# Altium schematic sheet JacdacMicroBitBackPackHi-Alt0 119.SchDoc: Complete design
size A4; DocumentNumber: 1; SheetNumber: 1; SheetTotal: 1; VersionControl_RevNumber: 1
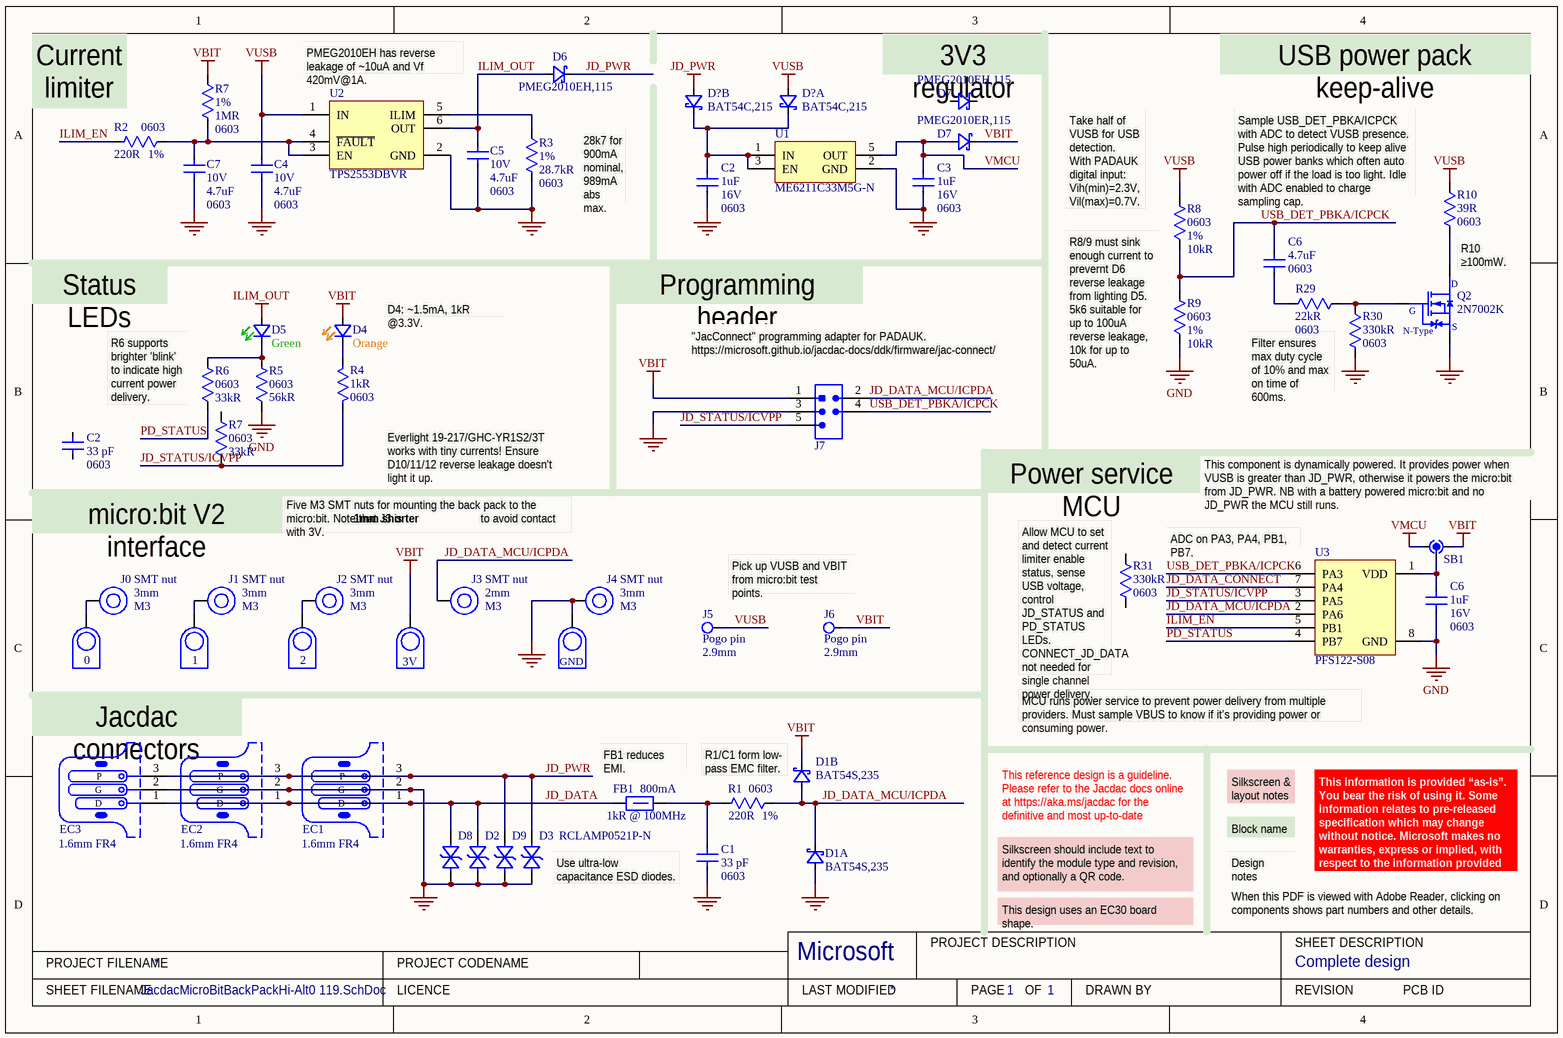
[diagram p0: JacdacMicroBitBackPackHi-Alt0 119.SchDoc]

## Parts
(Parts that share a designator on the sheet are numbered #1, #2 ... from top to bottom, then left to right.)
C1  33 pF  Case/Package: 0603  [CC0603]
C2#1  Voltage: 16V  Case/Package: 0603  Capacitance: 1uF  [C0603 - without outline]  (hidden comment: 1uF 16V)
C2#2  33 pF  Case/Package: 0603  [CC0603]
C3  Voltage: 16V  Case/Package: 0603  Capacitance: 1uF  [C0603 - without outline]  (hidden comment: 1uF 16V)
C4  Voltage Rating: 10V  Capacitance: 4.7uF  Case Code (Imperial): 0603  [C0603 - without outline]  (hidden comment: CL10A475KP8NNNC)
C5  Voltage Rating: 10V  Capacitance: 4.7uF  Case Code (Imperial): 0603  [C0603 - without outline]  (hidden comment: CL10A475KP8NNNC)
C6#1  Capacitance: 4.7uF  Case Code (Imperial): 0603  [C0603 - without outline]  (hidden comment: CL10A475KP8NNNC)
C6#2  Voltage: 16V  Case/Package: 0603  Capacitance: 1uF  [C0603 - without outline]  (hidden comment: 1uF 16V)
C7  Voltage Rating: 10V  Capacitance: 4.7uF  Case Code (Imperial): 0603  [C0603 - without outline]  (hidden comment: CL10A475KP8NNNC)
D1  Manufacturer Part Number: BAT54S,235  [NXP-BAT54S-TO-236AB - without outline]  (hidden comment: BAT54S)  (parts A,B of 2)
D2  RCLAMP0521P-N  [TVS 0402 - XL]  (value not drawn)
D3  RCLAMP0521P-N  [TVS 0402 - XL]
D4  Colour: Orange  [0603 Orange]  (hidden comment: 19-217/S2C-AQ1R1B/3T)
D5  Colour: Green  [0603 Green]
D6  PMEG2010EH,115  [SOD-123W]
D7#1  PMEG2010EH,115  [SOD-123W]
D7#2  PMEG2010ER,115  [SOD-123W]
D8  RCLAMP0521P-N  [TVS 0402 - XL]  (value not drawn)
D9  RCLAMP0521P-N  [TVS 0402 - XL]  (value not drawn)
D?#1  Manufacturer Part Number 1: BAT54C,215  [NXP-BAT54C - without outline]  (hidden comment: BAT54C)  (part B of 2)
D?#2  Manufacturer Part Number 1: BAT54C,215  [NXP-BAT54C - without outline]  (hidden comment: BAT54C)  (part A of 2)
EC1  PCB Type: 1.6mm FR4  [JACDAC_EDGE_CONNECTOR_NO_TRACES]  (hidden comment: 3 pin JACDAC edge connector)  (no BOM)
EC2  PCB Type: 1.6mm FR4  [JACDAC_EDGE_CONNECTOR_NO_TRACES]  (hidden comment: 3 pin JACDAC edge connector)  (no BOM)
EC3  PCB Type: 1.6mm FR4  [JACDAC_EDGE_CONNECTOR_NO_TRACES]  (hidden comment: 3 pin JACDAC edge connector)  (no BOM)
FB1  Current Rating: 800mA  Impedance: 1kR @ 100MHz  [TDK MPZ1608 0.8mm - without outline]  (hidden comment: TDK MPZ1608S102ATA00)
J0  SMT nut  Standoff Height: 3mm  Diameter: M3  [SMTSO-M3-3ET]
J1  SMT nut  Standoff Height: 3mm  Diameter: M3  [SMTSO-M3-3ET]
J2  SMT nut  Standoff Height: 3mm  Diameter: M3  [SMTSO-M3-3ET]
J3  SMT nut  Standoff Height: 2mm  Diameter: M3  [SMTSO-M3-2ET]
J4  SMT nut  Standoff Height: 3mm  Diameter: M3  [SMTSO-M3-3ET]
J5  Pogo pin  Working Height: 2.9mm  [HARWIN-P70-1000045R]
J6  Pogo pin  Working Height: 2.9mm  [HARWIN-P70-1000045R]
J7  Hack Connect Mini 1.27 mm pitch 2-row  [HACK_CONNECT_MINI_5_X_1_27_0.559mm_TH]  (value not drawn)  (no BOM)
J10  micro:bit ring hole  [Microbit_V2_Edge_Connector_Ring_P0]  (value not drawn)  (no BOM)
J11  micro:bit ring hole  [Microbit_V2_Edge_Connector_Ring_P1]  (value not drawn)  (no BOM)
J12  micro:bit ring hole  [Microbit_V2_Edge_Connector_Ring_P2]  (value not drawn)  (no BOM)
J13  micro:bit ring hole  [Microbit_V2_Edge_Connector_Ring_GND]  (value not drawn)  (no BOM)
J14  micro:bit ring hole  [Microbit_V2_Edge_Connector_Ring_3V]  (value not drawn)  (no BOM)
Q2  2N7002K  [SOT23-ONS]
R1  Tolerance: 1%  Case/Package: 0603  [RC0603]  (hidden comment: 220R)
R2  Tolerance: 1%  Case/Package: 0603  [RC0603]  (hidden comment: 220R)
R3  Tolerance: 1%  Resistance: 28.7kR  Case/Package: 0603  [RC0603]  (hidden comment: 28.7k)
R4  Resistance: 1kR  Case/Package: 0603  [RC0603]  (hidden comment: 1k)
R5  value 56kR  Package Size: 0603  [CC0603]  (hidden comment: RES0603_GENERIC)
R6  value 33kR  Package Size: 0603  [CC0603]  (hidden comment: RES0603_GENERIC)
R7#1  Tolerance: 1%  Resistance: 1MR  Case/Package: 0603  [RC0603-M]  (hidden comment: 1M)
R7#2  value 33kR  Package Size: 0603  [CC0603]  (hidden comment: RES0603_GENERIC)
R8  value 10kR  Package Size: 0603  Tolerance: 1%  [CC0603]  (hidden comment: RES0603_GENERIC)
R9  value 10kR  Package Size: 0603  Tolerance: 1%  [CC0603]  (hidden comment: RES0603_GENERIC)
R10  Resistance: 39R  Case Code (Imperial): 0603  [RC0603-M]  (hidden comment: RC0603FR-0739RL)
R29  value 22kR  Package Size: 0603  [CC0603]  (hidden comment: RES0603_GENERIC)
R30  value 330kR  Package Size: 0603  [CC0603]  (hidden comment: RES0603_GENERIC)
R31  value 330kR  Package Size: 0603  [CC0603]  (hidden comment: RES0603_GENERIC)
SB1  Three way open solder blob  [ThreeWaySolderBlob]  (value not drawn)  (no BOM)
U1  ME6211C33M5G-N  [MICRONE-SOT23-5]
U2  TPS2553DBVR  [TI-TPS2553 - without_outline]
U3  PFS122-S08  [SOP-8]

## Nets
GND: C1.1 C2#1.1 C3.1 C4.1 C5.1 C6#2.1 C7.1 D1.1(A) D2.2(A) D3.2(A) D8.2(A) D9.2(A) EC1.2(G) EC2.2(G) EC3.2(G) J4.1 J7.3(GND) J13.1 Q2.2(S) R3.1 R5.1 R9.1 R30.2 U1.2(GND) U2.2(GND) U3.8(GND)
ILIM_OUT: C5.2 D5.2(A) D6.2(A) U2.6(OUT)
JD_PWR: D3.1(K) D6.1(K) D9.1(K) D?#1.2(A) EC1.3(P) EC2.3(P) EC3.3(P)
VBIT: D1.2(K) D4.2(A) D7#2.1(K) J6.1 J7.1(VCC) J14.1 R7#1.2 SB1.1
VMCU: C3.2 D7#2.2(A) SB1.3 U1.5(OUT)
VUSB: C4.2 D?#2.1(A) J5.1 R8.2 R10.2 U2.1(IN)
ILIM_EN: R2.1 U3.5(PB1)
JD_DATA: D2.1(K) D8.1(K) EC1.1(D) EC2.1(D) EC3.1(D) FB1.1
JD_DATA_CONNECT: U3.7(PA4)
JD_DATA_MCU/ICPDA: D1.3(K) J3.1 J7.2(SWDIO) R1.2 U3.2(PA6)
JD_STATUS/ICVPP: J7.5(RESET) R4.2 R7#2.1 U3.3(PA5)
PD_STATUS: R6.1 U3.4(PB7)
USB_DET_PBKA/ICPCK: C6#1.1 J7.4(SWCLK) R8.1 R9.2 U3.6(PA3)
NetC1_2: C1.2 FB1.2 R1.1
NetC2#1_2: C2#1.2 D?#1.3(K) D?#2.3(K) U1.1(IN) U1.3(EN)
NetC6#1_2: C6#1.2 R29.2
NetC6#2_2: C6#2.2 SB1.2 U3.1(VDD)
NetC7_2: C7.2 R2.2 R7#1.1 U2.3(EN) U2.4(~{FAULT})
NetD4_1: D4.1(K) R4.1
NetD5_1: D5.1(K) R5.2 R6.2
NetJ0_1: J0.1 J10.1
NetJ1_1: J1.1 J11.1
NetJ2_1: J2.1 J12.1
NetQ2_1: Q2.1(G) R29.1 R30.1
NetQ2_3: Q2.3(D) R10.1
NetR3_2: R3.2 U2.5(ILIM)

Not connected (* = marked no-connect by the designer): C2#2 1 2; D7#1 1(K) 2(A); R7#2 2; R31 1 2

## Notes on the sheet
- (near R2) Current limiter
- (near U2) PMEG2010EH has reverse leakage of ~10uA and Vf 420mV@1A.
- (near D7#1) 3V3 regulator
- USB power pack keep-alive
- 28k7 for 900mA nominal,
  989mA abs max.
- (near R8) Take half of VUSB for USB detection.
  With PADAUK digital input: Vih(min)=2.3V, Vil(max)=0.7V.
- (near R10) Sample USB_DET_PBKA/ICPCK with ADC to detect VUSB presence. Pulse high periodically to keep alive USB power banks which often auto power off if the load is too light. Idle with ADC enabled to charge sampling cap.
- Status LEDs
- D4: ~1.5mA, 1kR @3.3V.
- Programming header
- R10 ≥100mW.
- (near J7) "JacConnect" programming adapter for PADAUK.
  https://microsoft.github.io/jacdac-docs/ddk/firmware/jac-connect/
- R8/9 must sink enough current to prevernt D6 reverse leakage from lighting D5. 5k6 suitable for up to 100uA reverse leakage, 10k for up to 50uA.
- Filter ensures max duty cycle of 10% and max on time of 600ms.
- (near R6) R6 supports brighter 'blink' to indicate high current power delivery.
- 1mm shorter
- (near R4) Everlight 19-217/GHC-YR1S2/3T works with tiny currents! Ensure D10/11/12 reverse leakage doesn't light it up.
- Power service MCU
- This component is dynamically powered. It provides power when VUSB is greater than JD_PWR, otherwise it powers the micro:bit from JD_PWR. NB with a battery powered micro:bit and no JD_PWR the MCU still runs.
- micro:bit V2 interface
- Five M3 SMT nuts for mounting the back pack to the micro:bit. Note that J3 is                         to avoid contact with 3V.
- ADC on PA3, PA4, PB1, PB7.
- Pick up VUSB and VBIT from micro:bit test points.
- (near U3) MCU runs power service to prevent power delivery from multiple providers. Must sample VBUS to know if it's providing power or consuming power.
- (near R31) Allow MCU to set and detect current limiter enable status, sense USB voltage, control JD_STATUS and PD_STATUS LEDs. CONNECT_JD_DATA not needed for single channel power delivery.
- Jacdac connectors
- (near FB1) FB1 reduces EMI.
- (near D1) R1/C1 form low- pass EMC filter.
- This reference design is a guideline. Please refer to the Jacdac docs online at https://aka.ms/jacdac for the definitive and most up-to-date information.
- Block name
- Silkscreen & layout notes
- Use ultra-low capacitance ESD diodes.
- This design uses an EC30 board shape.
- Silkscreen should include text to identify the module type and revision, and optionally a QR code.
- D1 clamps JD_DATA to protect MCU.
- Design notes
- When this PDF is viewed with Adobe Reader, clicking on components shows part numbers and other details.
- This information is provided “as-is”. You bear the risk of using it. Some information relates to pre-released specification which may change without notice. Microsoft makes no warranties, express or implied, with respect to the information provided here.
- PROJECT FILENAME
- PROJECT CODENAME
- Microsoft
- PROJECT DESCRIPTION
- SHEET DESCRIPTION
- SHEET FILENAME
- LICENCE
- LAST MODIFIED
- PAGE
- OF
- DRAWN BY
- REVISION
- PCB ID
- (in symbol 2N7002K) N-Type
- (in symbol micro:bit edge connector ring 3V) 3V
- (in symbol micro:bit edge connector ring GND) GND
- (in symbol micro:bit edge connector ring P0) 0
- (in symbol micro:bit edge connector ring P2) 2

## Library data of the parts
C1 C2#2 = CC0603JRNPO9BN330: 33pF 0603 100V C0G/NPO; Manufacturer: Yageo; Dielectric: C0G; Tolerance: 5%; Supplier 1: Digi-Key; Manufacturer Part Number: CC0603JRNPO9BN330; RoHS: Yes; Category: Ceramic Capacitors; Mount: Surface Mount; Weight: 7.1E-05oz; Case Code (Imperial): 0603; Case Code (Metric): 1608; Min Operating Temperature: -55°C; Max Operating Temperature: 125°C; Capacitance: 33pF; Termination: SMD/SMT; Composition: Ceramic; Packaging: Tape and Reel; Voltage Rating: 100V; Voltage Rating (DC): 100V; Length: 1.6mm; Height: 0.8mm; Thickness: 0.035inch; Depth: 0.8mm; Width: 0.8mm; Lead Free: Lead Free; ComponentLink1URL: https://datasheet.ciiva.com/13207/upy-gp-np0-16v-to-50v-8-13207786.pdf; ComponentLink1Description: Online datasheet; Manufacturer 1: Yageo; Manufacturer Part Number 1: CC0603JRNPO9BN330
C2#1 C3 C6#2 = CL10A105KO8NNNC: SMD Multilayer Ceramic Capacitor, 1 µF, 16 V, 0603 [1608 Metric], ± 10%, X5R, CL Series; Manufacturer: Samsung; ComponentLink1URL: https://datasheet.lcsc.com/lcsc/1811021622_Samsung-Electro-Mechanics-CL10A105KO8NNNC_C1592.pdfq; ComponentLink1Description: Online datasheet; Supplier 1: Digi-Key; Manufacturer Part Number: CL10A105KO8NNNC; RoHS: Yes; Category: Ceramic Capacitors; Stock 1: 3575337; Pricing 1: 1=0.10000, 10=0.03600, 50=0.01960, 100=0.01600, 500=0.01144, 1000=0.00898 (USD); Mount: Surface Mount; Case Code (Metric): 1608; Case Code (Imperial): 0603; Material: Ceramic; Contact Plating: Tin; Min Operating Temperature: -55°C; Max Operating Temperature: 85°C; Tolerance: 10%; Package Quantity: 1; Packaging: Tape and Reel; Voltage Rating: 16V; Dielectric: X5R; Voltage Rating (DC): 16V; Series: CL; Construction: Flat; Length: 1.6mm; Width: 0.031inch; Height: 0.8mm; Thickness: 0.035inch; Depth: 0.8mm; Radiation Hardening: No; Lead Free: Lead Free; RoHS Compliant: Yes; Supplier 2: Farnell; Supplier 3: RSComponents; Supplier 4: Mouser; Supplier Part Number 1: 1276-1034-1-ND; Supplier Part Number 2: 3013384; Supplier Part Number 3: 7664780; Supplier Part Number 4: 187-CL10A105KO8NNNC; Supplier 5: LCSC; Supplier Part Number 5: C1592; Manufacturer 1: Samsung; Manufacturer Part Number 1: CL10A105KO8NNNC
C4 C5 C6#1 C7 = CL10A475KP8NNNC: CAP CER 4.7UF 10V X5R 0603; Manufacturer: Samsung; Tolerance: 10%; Supplier 1: Farnell; Manufacturer Part Number: CL10A475KP8NNNC; RoHS: Yes; Category: Ceramic Capacitors; Stock 1: 75690; Pricing 1: 10=0.02700, 100=0.02160, 500=0.01580, 1000=0.01310, 2000=0.01130 (GBP); Mount: Surface Mount; Case/Package: 0603; Case Code (Metric): 1608; Contact Plating: Tin; Min Operating Temperature: -55°C; Max Operating Temperature: 85°C; Dielectric: X5R; Package Quantity: 1; Packaging: Tape and Reel; Series: CL; Construction: Flat; Length: 1.6mm; Width: 0.031inch; Height: 0.8mm; Thickness: 0.035inch; Depth: 0.8mm; Radiation Hardening: No; RoHS Compliant: Yes; ComponentLink1URL: https://datasheet.ciiva.com/25797/cl10a475kp8nnnc-25797520.pdf; ComponentLink1Description: Online datasheet; Supplier 2: Digi-Key; Pricing 2: 1=0.10000, 10=0.04900, 50=0.02680, 100=0.02180, 500=0.01558, 1000=0.01224 (USD); Supplier Part Number 2: 1276-1044-1-ND; Supplier Part Number 1: 3013398; Created By: D Gakure; Checked By: ?
  C6#1: Voltage Rating: 10V
D1 = BAT54S: DIODE ARRAY SCHOTTKY 30V SOT23; Manufacturer: Nexperia; Supplier 1: Digi-Key; RoHS: No; Category: Rectifier Diodes; Stock 1: 14011; Pricing 1: 1=0.13000, 10=0.11900, 100=0.05610, 500=0.03326, 1000=0.02185, 5000=0.02138 (USD); ComponentLink1URL: https://assets.nexperia.com/documents/data-sheet/BAT54_SER.pdf; ComponentLink1Description: NXP datasheet online; Supplier 2: Mouser; Supplier 3: RSComponents; Supplier Part Number 2: 771-BAT54S235; Supplier Part Number 3: 1707990; Supplier Part Number 1: 1727-1868-1-ND; Manufacturer 1: Nexperia; Manufacturer Part Number 1: BAT54S,235
D2 D3 D8 D9 = RCLAMP0521P-N: Bidirectional 5V (Max) 6V 16V 3.5A (8/20us) 0402 TVS RoHS; Manufacturer: Born Semiconductor; Package: 0402; Created By: D Gakure; Checked By: ?; Supplier1: LCSC; Supplier1 Part Number: C316043; ComponentLink1Description: Online datasheet; ComponentLink1URL: https://datasheet.lcsc.com/szlcsc/Bourne-Semicon-Shenzhen-RCLAMP0521P-N_C316043.pdf; Manufacturer Part Number: RCLAMP0521P-N; Manufacturer 1: Born Semiconductor; Manufacturer Part Number 1: RCLAMP0521P-N
D4 = 19-217/S2C-AQ1R1B/3T: LED ORANGE DIFFUSED 0603 SMD; Manufacturer: Everlight Elec; Manufacturer Part Number: 19-217/S2C-AQ1R1B/3T; Mount: Surface Mount; Case/Package: 0603; Color: Orange; Case Code (Imperial): 0603; ComponentLink1URL: https://datasheet.lcsc.com/lcsc/1912171731_Everlight-Elec-19-217-S2C-AQ1R1B-3T_C146215.pdf; ComponentLink1Description: Online datasheet; Supplier 1: LCSC; Supplier 1 Part Number: C146215
D5 = 19-217/GHC-YR1S2/3T: LED GREEN DIFFUSED 0603 SMD; Manufacturer 1: Everlight Elec; Manufacturer Part Number 1: 19-217/GHC-YR1S2/3T; Mount: Surface Mount; Case/Package: 0603; Color: Green; Case Code (Imperial): 0603; ComponentLink1URL: https://datasheet.lcsc.com/lcsc/1811101510_Everlight-Elec-19-217-GHC-YR1S2-3T_C72043.pdf; ComponentLink1Description: Online datasheet; Supplier 1: LCSC; Supplier 1 Part Number: C72043
D6 D7#1 = PMEG2010EH,115: NEXPERIA - PMEG2010EH,115 - DIODE, RECT SCH, 20V, 1A, SOD123f; Manufacturer: Nexperia; RoHS: Yes; RoHS Compliant: Yes; ComponentLink1URL: https://datasheet.lcsc.com/lcsc/2006101640_Nexperia-PMEG2010EH-115_C552825.pdf; ComponentLink1Description: Online datasheet; Manufacturer Part Number: PMEG2010EH,115
D7#2 = PMEG2010ER,115: NEXPERIA - PMEG2010ER,115 - DIODE, RECT SCH, 20V, 1A, SOD123W; Supplier 1: Digi-Key; Manufacturer: Nexperia; RoHS: Yes; Stock 1: 722; Pricing 1: 1=0.42000, 10=0.31300, 100=0.19480, 500=0.13328, 1000=0.10252 (USD); RoHS Compliant: Yes; ComponentLink1URL: http://www.farnell.com/datasheets/1383341.pdf; ComponentLink1Description: Online datasheet; Supplier 2: Future Electronics; Stock 2: 144000; Pricing 2: 3000=0.20000, 6000=0.16300, 9000=0.16200, 12000=0.16100, 15000=0.16000 (USD); Supplier 3: RSComponents; Stock 3: 1; Pricing 3: 50=0.32100, 100=0.26700, 250=0.21200, 500=0.11100, 1000=0.08200 (USD); Supplier 4: Mouser; Stock 4: 2146; Pricing 4: 1=0.37000, 10=0.25700, 50=0.25700, 100=0.13400, 1000=0.09400, 10000=0.07200 (USD); Supplier 5: Farnell; Stock 5: 24250; Pricing 5: 5=0.40400, 10=0.27600, 100=0.13400, 500=0.11500, 1000=0.07750 (GBP); Supplier Part Number 5: 1907681; Supplier Part Number 4: 771-PMEG2010ER115; Supplier Part Number 3: 8166824P; Supplier Part Number 2: 4222907; Supplier Part Number 1: 1727-5192-1-ND; Manufacturer Part Number: PMEG2010ER,115
D?#1 D?#2 = BAT54C: BAT54 Series 30V 2 uA Surface Mount Schottky Barrier Diode - SOT-23; Manufacturer 1: Nexperia; Manufacturer: Manufacturer 1; Supplier 1: Digi-Key; RoHS: No; Category: Rectifier Diodes; Stock 1: 155983; Pricing 1: 1=0.13000, 10=0.11900, 100=0.05610, 500=0.03326, 1000=0.02185 (USD); ComponentLink2URL: https://assets.nexperia.com/documents/data-sheet/BAT54C.pdf; ComponentLink2Description: NXP datasheet online; Supplier 2: Farnell; Supplier 3: Mouser; Supplier 4: RSComponents; Supplier Part Number 4: 4367789; Supplier Part Number 3: 771-BAT54C-T/R; Supplier Part Number 2: 1081192; Supplier Part Number 1: 1727-2902-1-ND; Manufacturer Part Number: BAT54C,215
EC1-EC3 = Jacdac edge connector: 3 pin Jacdac edge connector 1.27mm pitch; Manufacturer Part Number: JACDAC_EDGE_CONNECTOR; Checked By: ?; Created By: D. Gakure; ComponentLink1Description: Yuliang JACDAC cable connector drawing online; ComponentLink1URL: https://github.com/microsoft/jacdac-mdk/blob/main/connector/JACDAC-Connector-by-Yuliang-2020-11-28.pdf; ComponentLink2Description: JACDAC PCB edge connector spec onlin; ComponentLink2URL: https://github.com/microsoft/jacdac-mdk/blob/main/connector/JACDAC_PCB_Edge_Connector_Drawing_JD-PEC-01_rev_01.pdf
FB1 = TDK MPZ1608S102ATA00: 0603 1k@100MHz 0.8A chip; Core Material: Ferrite; Tolerance: 25%; DC Resistance (DCR): 300mR; Supplier 1: Digi-Key; Stock 1: 113542; Pricing 1: 1=0.1, 10=0.079, 25=0.0716, 50=0.0644, 100=0.0472, 250=0.03432, 500=0.03146, 1000=0.02717 (USD); Mount: Surface Mount; Case/Package: 0603; Case Code (Metric): 1608; Case Code (Imperial): 0603; Package Quantity: 4000; Packaging: Tape and Reel; Max DC Current: 800mA; Length: 0.063inch; Height: 0.037inch; Width: 0.031inch; ComponentLink2URL: https://www.mouser.co.uk/datasheet/2/400/eads_commercial_power_mpz1608_en-923650.pdf; ComponentLink2Description: datasheet online; Supplier 2: Mouser; ComponentLink3Description: datasheet; ComponentLink3URL: Y:\System\Altium\Libraries 2014\TDK\Datasheets\eads_commercial_power_mpz1608_en-923650.pdf; Supplier Part Number 1: 445-8694-1-ND; Supplier Part Number 2: 810-MPZ1608S102ATA00; Manufacturer: TDK; Manufacturer Part Number: MPZ1608S102ATA00; Manufacturer 1: TDK; Manufacturer Part Number 1: MPZ1608S102ATA00
J0-J2 J4 = SMTSO-M3-3ET: Standoff Round Swage F/F M3 X 0.5-THD Carbon Steel Electro-Tin ASTM B545 Automotive; Manufacturer 1: PennEngineering; Supplier 1: Mouser; Manufacturer Part Number 1: SMTSO-M3-3ET; RoHS: No; Supplier Part Number 1: 153-SMTSO-M3-3ET; Manufacturer: PennEngineering; Manufacturer Part Number: SMTSO-M3-3ET
J3 = SMTSO-M3-2ET: Standoff Round Swage F/F M3 X 0.5-THD Carbon Steel Electro-Tin ASTM B545 Automotive; Manufacturer 1: PennEngineering; Supplier 1: Mouser; Manufacturer Part Number 1: SMTSO-M3-2ET; RoHS: No; Supplier Part Number 1: 153-SMTSO-M3-2ET; Manufacturer: PennEngineering; Manufacturer Part Number: SMTSO-M3-2ET
J5 J6 = HARWIN-P70-1000045R: Spring Loaded Contact, Pin, 2.9mm, SMT; Manufacturer 1: Harwin; Plating: Gold; Current Rating: 2A; Supplier 1: Digi-Key; Manufacturer Part Number 1: P70-1000045R; RoHS: Yes; Category: Connectors; Stock 1: 1152; Pricing 1: 1=1.02000, 10=0.85900, 25=0.82400, 50=0.80660, 100=0.77150, 250=0.70140, 500=0.63126 (USD); Mount: Surface Mount; Material: Brass; REACH SVHC: No SVHC; RoHS Compliant: Yes; ComponentLink1URL: https://cdn.harwin.com/pdfs/P70-10X.pdf; ComponentLink1Description: Harwin drawing online; ComponentLink2URL: http://www.farnell.com/datasheets/2151575.pdf; ComponentLink2Description: Harwin catalogue page online; Manufacturer Part Number: P70-1000045R; Manufacturer: Harwin; Supplier Part Number 1: 952-3127-1-ND; Supplier 2: Farnell; Supplier 3: Mouser; Supplier Part Number 2: 2664910; Supplier Part Number 3: 855-P70-1000045R; Length: 3.5mm
J7 = HACK_CONNECT_MINI
J10 = micro:bit edge connector ring P0: One ring like those on the micro:bit edge connector, designed to take a 4mm banana plug
J11 = micro:bit edge connector ring P1: One ring like those on the micro:bit edge connector, designed to take a 4mm banana plug
J12 = micro:bit edge connector ring P2: One ring like those on the micro:bit edge connector, designed to take a 4mm banana plug
J13 = micro:bit edge connector ring GND: One ring like those on the micro:bit edge connector, designed to take a 4mm banana plug
J14 = micro:bit edge connector ring 3V: One ring like those on the micro:bit edge connector, designed to take a 4mm banana plug
Q2 = 2N7002K: MOSFET Transistor, N Channel, 300 mA, 60 V, 2 ohm, 10 V, 2.5 V; Manufacturer: ON Semiconductor / Fairchild; Max Power Dissipation: 350mW; Continuous Drain Current (ID): 300mA; Input Capacitance: 50pF; Number of Elements: 1; Rds On Max: 2R; Drain to Source Breakdown Voltage: 60V; Threshold Voltage: 2.5V; Element Configuration: Single; Gate to Source Voltage (Vgs): 20V; Turn-Off Delay Time: 30ns; Turn-On Delay Time: 5ns; Polarity: N-CHANNEL; Supplier 1: Digi-Key; Stock 1: 53564; Pricing 1: 1=0.40000, 10=0.32500, 25=0.27240, 100=0.17240, 500=0.11344, 1000=0.07714 (USD); Case/Package: SOT-23; Number of Pins: 3; Contact Plating: Tin,Matte; Min Operating Temperature: -55°C; Max Operating Temperature: 150°C; Packaging: Tape and Reel; Power Dissipation: 350mW; Package Quantity: 1; Drain to Source Resistance: 2R; On-State Resistance: 2R; Length: 2.92mm; Height: 1.2mm; Width: 1.3mm; Radiation Hardening: No; Lead Free: Lead Free; REACH SVHC: No SVHC; Supplier 2: Mouser; ComponentLink1Description: Online datasheet; ComponentLink1URL: https://www.onsemi.com/pdf/datasheet/2n7002k-d.pdf; Supplier Part Number 2: 512-2N7002K; Supplier Part Number 1: 2N7002KCT-ND; Manufacturer Part Number: 2N7002K; Supplier 3: Farnell; Supplier Part Number 3: 2453382; Category: MOSFETs; Checked By: ?; Created By: D. Gakure; Drain-source On Resistance-Max: 2R; Drain to Source Voltage (Vdss): 60V; Mount: Surface Mount; Pricing 2: 1=0.40000, 10=0.27300, 50=0.27300, 100=0.13400, 1000=0.07800, 10000=0.05100 (USD); Pricing 3: 5=0.34800, 10=0.23500, 100=0.09100, 500=0.05850, 3000=0.04630, 9000=0.03860, 24000=0.03750, 45000=0.03530 (GBP); RoHS: Yes; Stock 2: 111825; Stock 3: 101059; Voltage: 60V
R1 R2 = RC0603FR-07220RL: Res Thick Film 0603 220 Ohm 1% 0.1W(1/10W) ±100ppm/°C Pad SMD T/R; Manufacturer 1: Yageo; Voltage Rating (DC): 50V; Power Rating: 100mW; ComponentLink4URL: https://datasheet.ciiva.com/46395/443971-46395002.pdf; ComponentLink4Description: online datasheet; Supplier 1: Digi-Key; Manufacturer Part Number 1: RC0603FR-07220RL; RoHS: Yes; Category: Chip SMD Resistors; Stock 1: 1257522; Pricing 1: 1=0.10000, 10=0.02300, 100=0.00930, 1000=0.00417, 2500=0.00362 (USD); Number of Pins: 2; Case Code (Imperial): 0603; Case Code (Metric): 1608; Size Code: 0603; Min Operating Temperature: -55°C; Max Operating Temperature: 155°C; Resistor Type: Thick Film; Temperature Coefficient: 100ppm/°C; Packaging: Tape and Reel; Voltage Rating: 50V; Package Quantity: 1; Termination: SMD/SMT; Number of Terminations: 2; Max Power Dissipation: 100mW; Features: Moisture Resistant; Series: RC; Resistance Tolerance: 1%; Construction: Rectangular; Length: 1.6mm; Width: 0.031inch; Height: 0.022inch; Depth: 0.8mm; REACH SVHC: No SVHC; Lead Free: Lead Free; RoHS Compliant: Yes; Military Standard: Not; Supplier 2: Farnell; Supplier 3: Mouser; Supplier 4: RSComponents; Supplier Part Number 2: 2421863; Supplier Part Number 3: 603-RC0603FR-07220RL; Supplier Part Number 4: 1995497; Supplier Part Number 1: 311-220HRCT-ND; Manufacturer: Yageo; Manufacturer Part Number: RC0603FR-07220RL; Resistance: 220R
R3 = RC0603FR-0728K7L: Res Thick Film 0603 28.7k Ohm 1% 0.1W(1/10W) ±100ppm/C Pad SMD T/R; Manufacturer 1: Yageo; Voltage Rating: 50V; Power Rating: 100mW; Temperature Coefficient: 100ppm/°C; Supplier 1: Digi-Key; Manufacturer Part Number 1: RC0603FR-0728K7L; RoHS: Yes; Category: Chip SMD Resistors; Stock 1: 276730; Pricing 1: 1=0.10000, 10=0.02300, 100=0.00930, 1000=0.00417, 2500=0.00362 (USD); Mount: Surface Mount; Case Code (Imperial): 0603; Case Code (Metric): 1608; Size Code: 0603; Min Operating Temperature: -55°C; Max Operating Temperature: 155°C; Packaging: Tape and Reel; Package Quantity: 1; Resistor Type: Thick Film; Termination: SMD/SMT; Number of Terminations: 2; Max Power Dissipation: 100mW; Voltage Rating (DC): 50V; Features: Moisture Resistant; Series: RC; Construction: Rectangular; Technology: THICK FILM; Length: 1.6mm; Width: 0.031inch; Height: 0.022inch; Depth: 0.8mm; Military Standard: Not; Lead Free: Lead Free; RoHS Compliant: Yes; ComponentLink5URL: https://datasheet.ciiva.com/2553/pyu-r-int-thick-7-2553533.pdf; ComponentLink5Description: onilne datasheet; Manufacturer: Yageo; Manufacturer Part Number: RC0603FR-0728K7L; Supplier 2: Farnell; Supplier 3: Mouser; Supplier 4: RSComponents; Supplier Part Number 1: 311-28.7KHRCT-ND; Supplier Part Number 2: 3951071; Supplier Part Number 3: 603-RC0603FR-0728K7L; Supplier Part Number 4: 505-1003
R4 = RC0603FR-071KL: Res Thick Film 0603 1K Ohm 1% 1/10W ±100ppm/°C Molded SMD SMD Paper T/R; Manufacturer: Yageo; Power Rating: 100mW; Voltage Rating: 50V; ComponentLink4URL: https://datasheet.ciiva.com/46395/443971-46395002.pdf; ComponentLink4Description: online datasheet; Manufacturer Part Number: RC0603FR-071KL; Supplier 1: Digi-Key; Manufacturer 1: Yageo; Manufacturer Part Number 1: RC0603FR-071KL; RoHS: Yes; Category: Chip SMD Resistors; Stock 1: 7298696; Pricing 1: 1=0.10000, 10=0.02300, 100=0.00930, 1000=0.00417, 2500=0.00362 (USD); Contact Plating: Tin,Matte; Case Code (Imperial): 0603; Case Code (Metric): 1608; Size Code: 0603; Min Operating Temperature: -55°C; Max Operating Temperature: 155°C; Temperature Coefficient: 100ppm/°C; Resistor Type: Thick Film; Packaging: Tape and Reel; Termination: SMD/SMT; Features: Moisture Resistant; Series: RC; Max Power Dissipation: 100mW; Number of Terminations: 2; Technology: THICK FILM; Resistance Tolerance: 1%; Construction: Rectangular; Length: 1.6mm; Height: 0.45mm; Depth: 0.8mm; Radiation Hardening: No; REACH SVHC: No SVHC; Lead Free: Lead Free; Military Standard: Not; RoHS Compliant: Yes; Supplier 2: Farnell; Supplier 3: Mouser; Supplier 4: RSComponents; Supplier Part Number 1: 311-1.00KHRCT-ND; Supplier Part Number 2: 2421849; Supplier Part Number 3: 603-RC0603FR-071KL; Supplier Part Number 4: 1995478; Tolerance: 1%
R5 R6 R7#2 R29-R31 = RES0603_GENERIC: Generic 0603 resistor; Power: *mW; Tolerance: 1%; Manufacturer: Generic
R7#1 = RC0603FR-071ML: Res Thick Film 0603 1M Ohm 1% 0.1W(1/10W) ±100ppm/C Pad SMD T/R; Manufacturer 1: Yageo; Voltage Rating: 50V; Power Rating: 100mW; Temperature Coefficient: 100ppm/°C; Manufacturer Part Number 1: RC0603FR-071ML; RoHS: Yes; Category: Chip SMD Resistors; Mount: Surface Mount; Case Code (Imperial): 0603; Case Code (Metric): 1608; Size Code: 0603; Min Operating Temperature: -55°C; Max Operating Temperature: 155°C; Packaging: Tape and Reel; Package Quantity: 1; Resistor Type: Thick Film; Termination: SMD/SMT; Number of Terminations: 2; Max Power Dissipation: 100mW; Voltage Rating (DC): 50V; Features: Moisture Resistant; Series: RC; Construction: Rectangular; Technology: THICK FILM; Length: 1.6mm; Width: 0.031inch; Height: 0.022inch; Depth: 0.8mm; Military Standard: Not; Lead Free: Lead Free; RoHS Compliant: Yes; ComponentLink5URL: https://datasheet.ciiva.com/2553/pyu-r-int-thick-7-2553533.pdf; ComponentLink5Description: onilne datasheet; Manufacturer: Yageo; Manufacturer Part Number: RC0603FR-071ML; Supplier 1: Digi-Key; Supplier 2: Farnell; Supplier 3: Mouser; Supplier 4: RSComponents; Supplier Part Number 4: 1995481; Supplier Part Number 3: 603-RC0603FR-071ML; Supplier Part Number 2: 9238840; Supplier Part Number 1: 311-1.00MHRCT-ND
R8 R9 = RES0603_GENERIC: Generic 0603 resistor; Power: *mW; Manufacturer: Generic
R10 = RC0603FR-0739RL: RES SMD 39 OHM 1% 1/10W 0603; Manufacturer: Yageo; Power Rating: 100mW; Voltage Rating: 50V; Temperature Coefficient: 100ppm/°C; Working Voltage: 75V; Manufacturer Part Number: RC0603FR-0739RL; RoHS: Yes; Category: Chip SMD Resistors; Case/Package: 0603; Case Code (Metric): 1608; Min Operating Temperature: -55°C; Max Operating Temperature: 155°C; Packaging: Tape and Reel; Package Quantity: 1; Termination: SMD/SMT; Resistor Type: Thick Film; Number of Terminations: 2; Max Power Dissipation: 100mW; Voltage Rating (DC): 50V; Features: Moisture Resistant; Series: RC; Construction: Rectangular; Technology: THICK FILM; Resistance Tolerance: 1%; Length: 1.6mm; Width: 0.8mm; Height: 0.45mm; Depth: 0.8mm; REACH SVHC: No SVHC; Military Standard: Not; Lead Free: Lead Free; RoHS Compliant: Yes; ComponentLink1URL: https://datasheet.ciiva.com/11819/0900766b80f96399-11819290.pdf; ComponentLink1Description: Online datasheet; Created By: D. Gakure; Tolerance: 1%
SB1 = ThreeWaySolderBlob
U1 = ME6211C33M5G-N: 6V 260mV @ 200mA(typ) - - Fixed 3.3V SOT-23-5 Linear Voltage Regulators (LDO) ROHS; manufacturer: MICRONE(Nanjing Micro One Elec); Output Current: 500mA; Output Configuration: Positive; Number of Regulators: 1; Max Input Voltage: 6; Dropout Voltage: 200mV; Supplier Part Number: C82942; Category: Voltage Regulators - Linear; Stock 1: 32529; Pricing 1: 1=0.33000, 10=0.24900, 25=0.21760, 100=0.12440, 250=0.11664, 500=0.09330, 1000=0.07153 (USD); Mount: Surface Mount; Case/Package: SOT-23-5; Supplier 1: LCSC; Output Type: Fixed; Min Output Voltage: 3.3V; ComponentLink3URL: https://datasheet.lcsc.com/lcsc/1811131510_MICRONE-Nanjing-Micro-One-Elec-ME6211C33M5G-N_C82942.pdf; ComponentLink3Description: On Semi datasheet online; Created: DG; Manufacturer Part Number: ME6211C33M5G-N; Manufacturer 1: MICRONE(Nanjing Micro One Elec); Manufacturer Part Number 1: ME6211C33M5G-N
U2 = TPS2553DBVR: IC PWR SWITCH N-CHAN 1:1 SOT23-6; Manufacturer: Texas Instruments; Number of Outputs: 1; Min Supply Voltage: 2.5V; Max Supply Voltage: 6.5V; On-State Resistance: 85mR; Output Current: 1.5A; Max Power Dissipation: 625mW; Supplier 1: Digi-Key; RoHS: Yes; Category: Hot Swap Controllers; Stock 1: 14713; Pricing 1: 1=1.20000, 10=1.07100, 25=1.01640, 100=0.78050, 250=0.68972, 500=0.65340, 1000=0.50820 (USD); Case/Package: SOT-23; Number of Pins: 6; Weight: 0.00127oz; Min Operating Temperature: -40°C; Max Operating Temperature: 85°C; Packaging: Tape and Reel; Package Quantity: 1; Max Input Voltage: 6.5V; Min Input Voltage: 2.5V; Radiation Hardening: No; Lead Free: Lead Free; REACH SVHC: No SVHC; ComponentLink1URL: https://datasheet.ciiva.com/15108/getdatasheetpartid-297517-15108509.pdf; ComponentLink1Description: Online datasheet; Supplier 2: Farnell; Supplier 3: Mouser; Supplier Part Number 3: 595-TPS2553DBVR; Supplier Part Number 2: 3124082; Supplier Part Number 1: 296-32464-1-ND; Manufacturer Part Number: TPS2553DBVR
U3 = PFS122-SO8: 8bit MTP MCU with 12-bit ADC; Manufacturer: PADAUK; ComponentLink1Description: Online datasheet; ComponentLink1URL: http://www.padauk.com.tw/upload/doc/PFS122%20datasheet_EN_V001_20220518.pdf; Package: SOP-8; Manufacturer Part Number: PFS122-S08